# Altium schematic sheet SWD Connector.SchDoc
size A4; CarNumber: 6; Author: Wojciech Grędel; CompanyName: AGH Racing; DocumentNumber: 10; Revision: 3; SheetNumber: 1; SheetTotal: 1
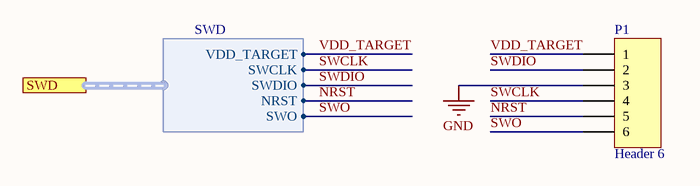
[diagram p0: SWD Connector.SchDoc]

## Parts
P1  Header 6  [HDR_2x3_2.54_SMT]

## Ports
SWD (harness SWD)

## Harnesses
SWD: VDD_TARGET, SWCLK, SWDIO, NRST, SWO

## Nets
GND: P1.3
NRST: P1.5 ; port SWD.NRST
SWCLK: P1.4 ; port SWD.SWCLK
SWDIO: P1.2 ; port SWD.SWDIO
SWO: P1.6 ; port SWD.SWO
VDD_TARGET: P1.1 ; port SWD.VDD_TARGET

## Notes on the sheet
- Confidential / Not for distribution !
- Document name:
- Designer Name:
- Date/Time:
- Revision:

## Library data of the parts
P1 = Header 6: Header, 6-Pin